# Altium schematic sheet Notes.SchDoc
size A; DocumentNumber: 14; SheetNumber: 14; SheetTotal: 16
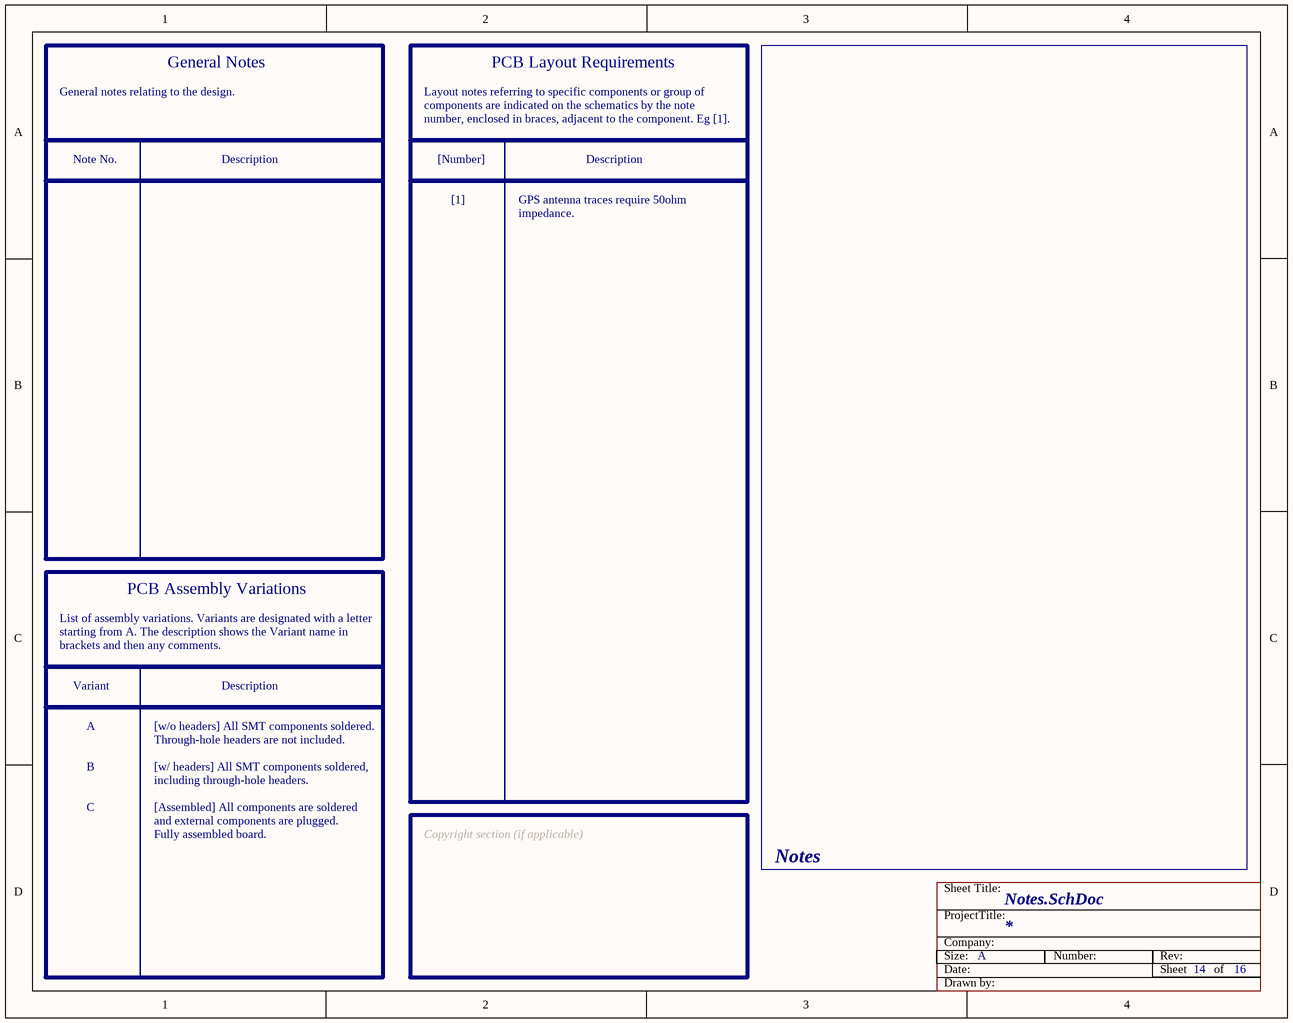
[diagram p0: Notes.SchDoc]

## Notes on the sheet
- General notes relating to the design.
- General Notes
- Layout notes referring to specific components or group of
- PCB Layout Requirements
- Note No.
- Description
- components are indicated on the schematics by the note
- number, enclosed in braces, adjacent to the component. Eg [1].
- [Number]
- [1]
- GPS antenna traces require 50ohm
- impedance.
- List of assembly variations. Variants are designated with a letter
- starting from A. The description shows the Variant name in
- PCB Assembly Variations
- brackets and then any comments.
- Variant
- A
- B
- [w/o headers] All SMT components soldered.
- Through-hole headers are not included.
- [w/ headers] All SMT components soldered,
- C
- including through-hole headers.
- [Assembled] All components are soldered
- and external components are plugged.
- Fully assembled board.
- Copyright section (if applicable)
- Notes
- Sheet Title:
- ProjectTitle:
- Size:
- Date:
- Company:
- Number:
- Rev:
- Sheet         of
- Drawn by: